# EasyEDA schematic SCH_placa_Rorgerio_IGBT_2026-07-28.json
TITLE: Sheet_1; REV: 1.0; Date: 2026-02-24; Sheet: 1/1; Company: Your Company
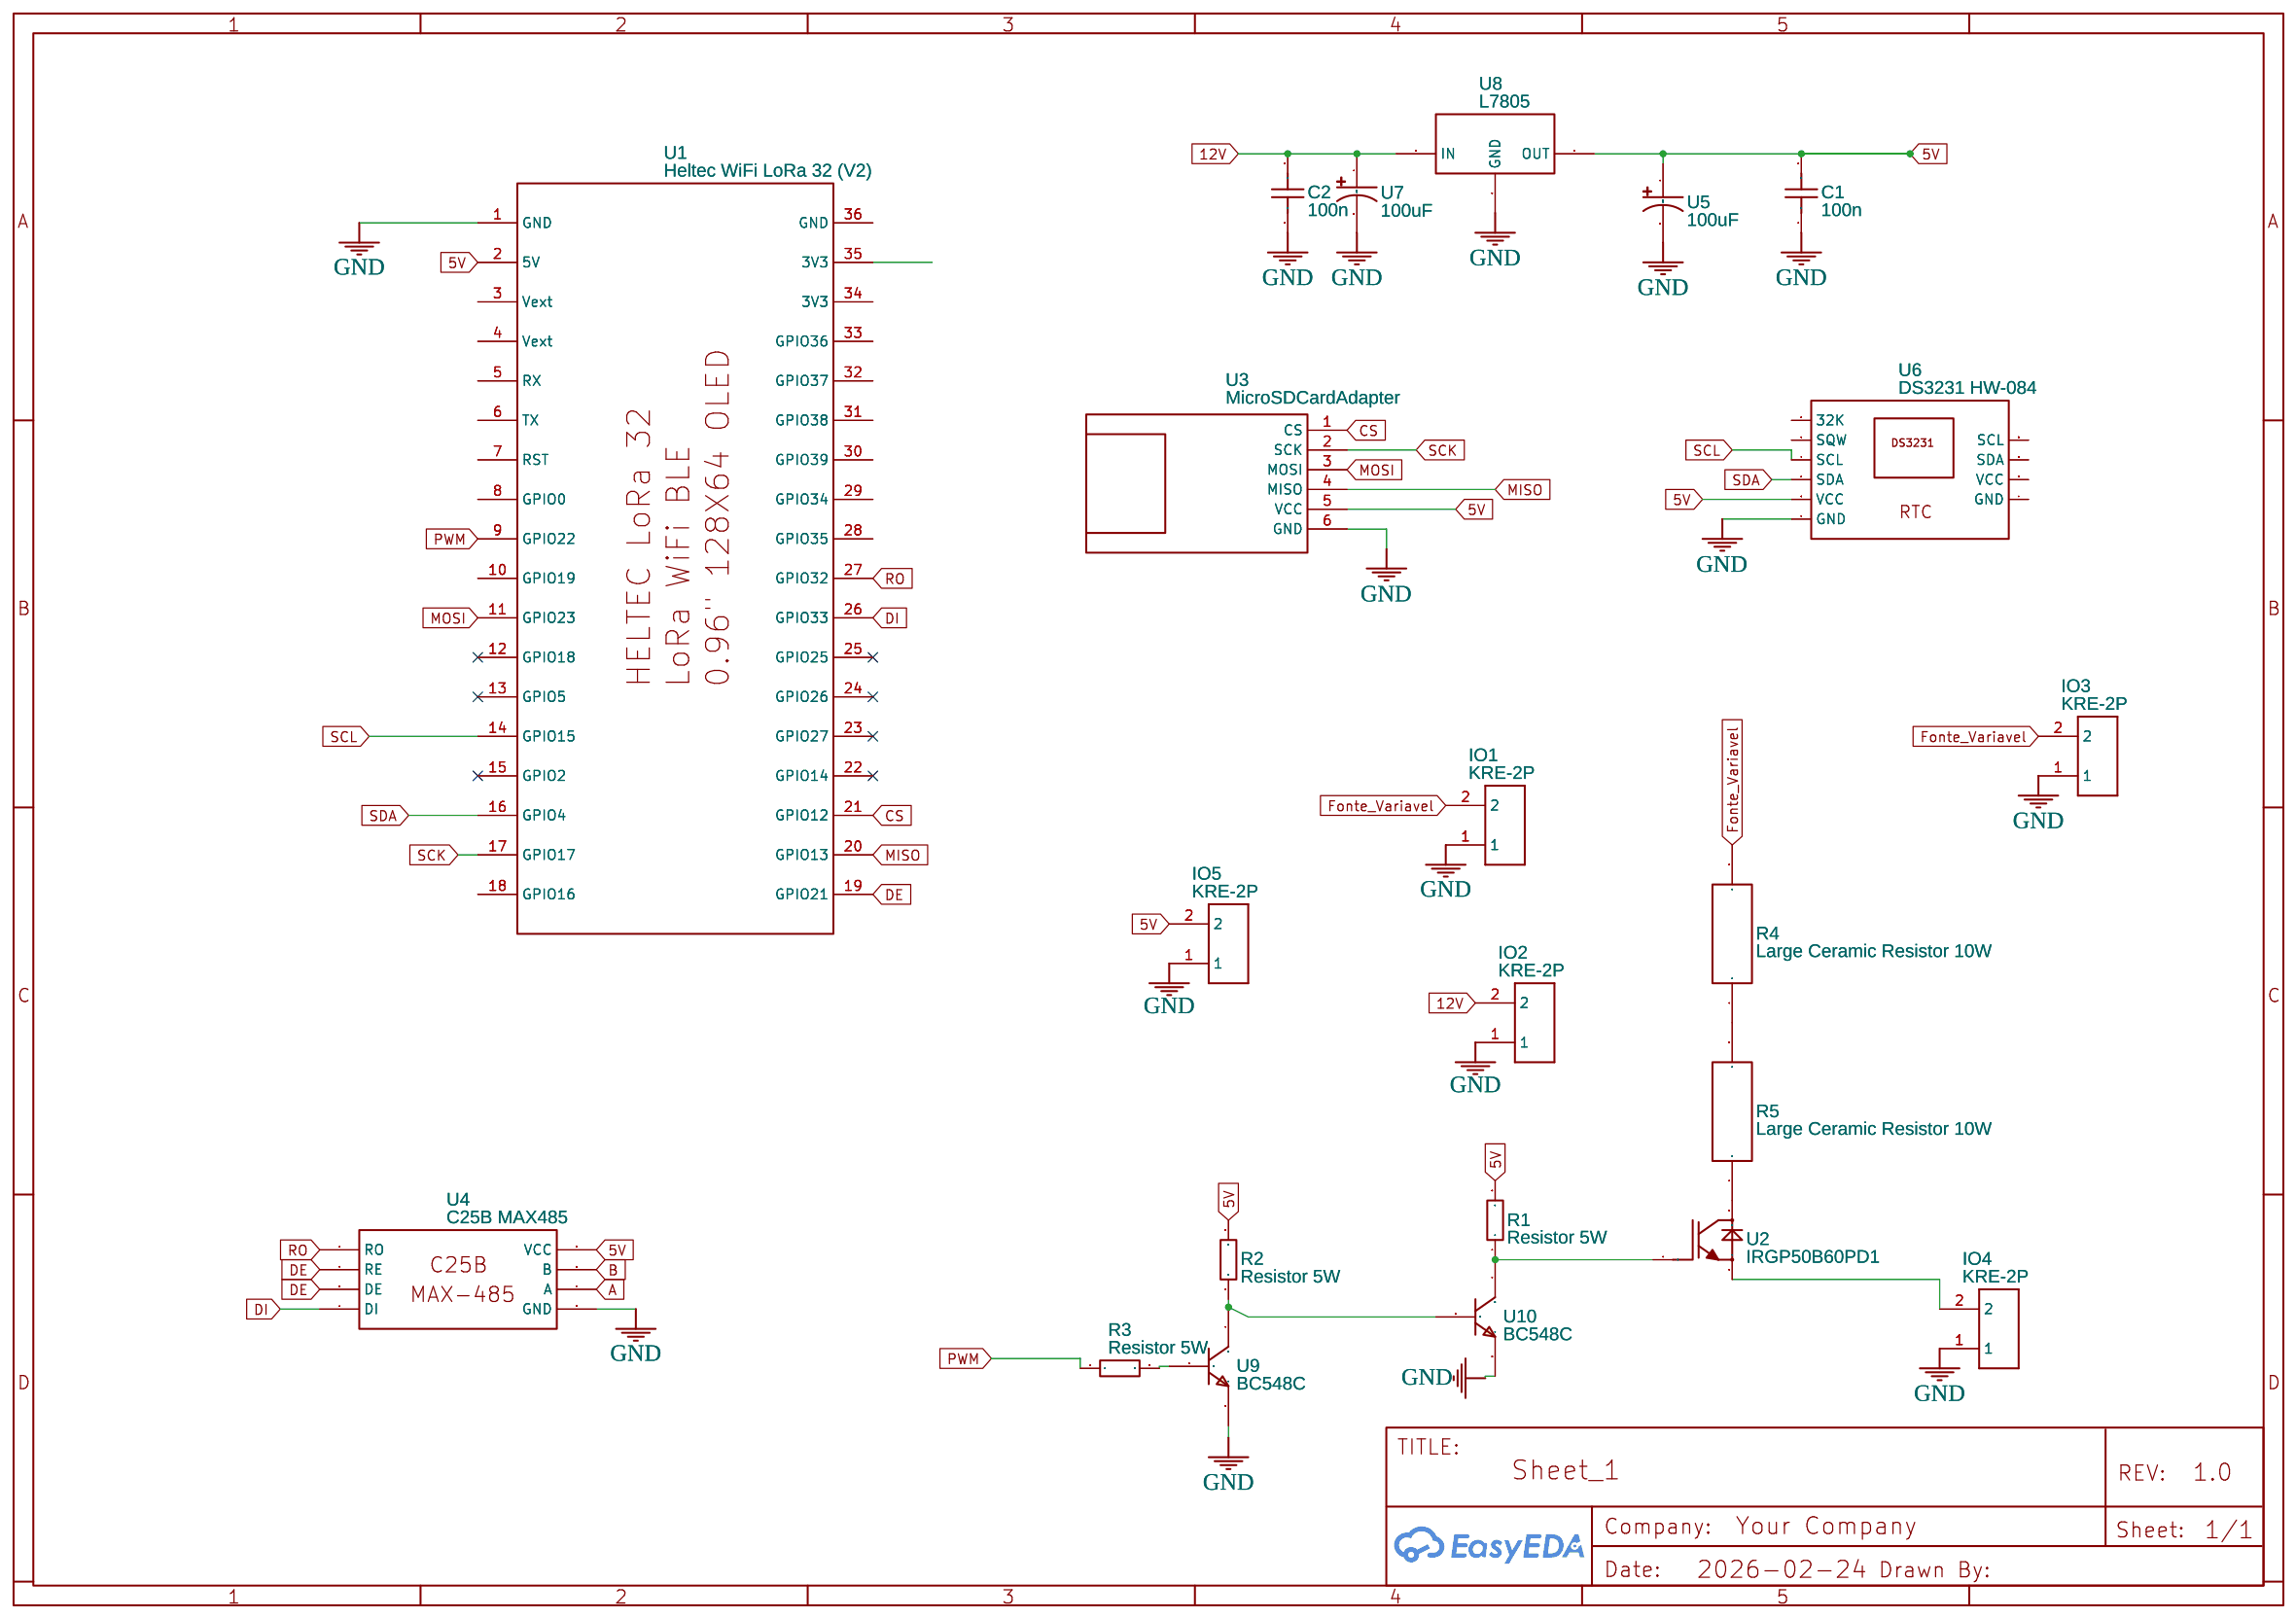
[diagram p0: schematic sheet]

## Parts
C1  100n  [100NF 63V MKS4-100N/100 WIMA]
C2  100n  [100NF 63V MKS4-100N/100 WIMA]
IO1  KRE-2P  [KRE-2P]
IO2  KRE-2P  [KRE-2P]
IO3  KRE-2P  [KRE-2P]
IO4  KRE-2P  [KRE-2P]
IO5  KRE-2P  [KRE-2P]
R1  Resistor 5W  [RESISTOR 5W]
R2  Resistor 5W  [RESISTOR 5W]
R3  Resistor 5W  [RESISTOR 5W]
R4  Large Ceramic Resistor 10W  [LARGE-CERAMIC-RESISTOR-10W-8OHM]
R5  Large Ceramic Resistor 10W  [LARGE-CERAMIC-RESISTOR-10W-8OHM]
U1  Heltec WiFi LoRa 32 (V2)  [HELTEC-LORA32-WIFI-BLE-OLED V2 A]
U2  IRGP50B60PD1  [MOSFET-D]
U3  MicroSDCardAdapter  [MICROSDCARDADAPTER]
U4  C25B MAX485  [C25B MAX485]
U5  100uF  [CAP100UF25V]
U6  DS3231 HW-084  [DS3231 HW-084]
U7  100uF  [CAP100UF25V]
U8  L7805  [L7805]
U9  BC548C  [BC548C]
U10  BC548C  [BC548C]

## Library data of the parts
C1 C2 = C_0603_US: Contributor: SrQuark
IO1-IO5 = KRE-2P: KRE Conector 2P
R1-R3 = Resistor 5W: Power: 2W; Tolerance: ±1%; Supplier Part: C57435; Supplier: LCSC; Manufacturer: UniOhm; Contributor: hafiz_8030
R4 R5 = Large Ceramic Resistor 10W: Manufacturer Part: Yontex MKP 250V 6.8uF; Contributor: azhaque
U1 = Heltec WiFi LoRa 32 (V2): Manufacturer: Heltec; Manufacturer Part: Heltec WiFi LoRa 32(V2); Supplier: Heltec; Supplier Part: Heltec WiFi LoRa 32(V2); link: https://heltec.org/project/wifi-lora-32/; Contributor: Domino2205
U2 = IRGP50B60PD1: Contributor: ledhengsant55
U3 = MicroSDCardAdapter: Contributor: sahilrnikam; Package Display: No; Supplier: Benewake
U4 = C25B MAX485: Contributor: Ahmad Burhan
U5 U7 = Cap100uF25V: Contributor: kevin_wu; Supplier: LCSC; Supplier Part: C2972604; Manufacturer: NCC(日本贵弥功); Manufacturer Part: EKY-101ETD101MK16S
U6 = DS3231 HW-084: Contributor: KSM_MA
U8 = L7805: Contributor: roihan.abror
U9 U10 = BC548C: Contributor: dale_willey

## Nets
5V: C1.2 IO5.2 R1.2 R2.2 U1.2(5V) U3.5(VCC) U4.5(VCC) U5.1 U6.2(VCC) U8.1(OUT)
12V: C2.2 IO2.2 U7.1 U8.3(IN)
GND: C1.1 C2.1 IO1.1 IO2.1 IO3.1 IO4.1 IO5.1 U1.1(GND) U3.6(GND) U4.8(GND) U5.2 U6.1(GND) U7.2 U8.2(GND) U9.3(E) U10.3(E)
A: U4.7(A)
B: U4.6(B)
CS: U1.21(GPIO12) U3.1(CS)
DE: U1.19(GPIO21) U4.2(RE) U4.3(DE)
DI: U1.26(GPIO33) U4.4(DI)
Fonte_Variavel: IO1.2 IO3.2 R4.2
MISO: U1.20(GPIO13) U3.4(MISO)
MOSI: U1.11(GPIO23) U3.3(MOSI)
PWM: R3.1 U1.9(GPIO22)
RO: U1.27(GPIO32) U4.1(RO)
SCK: U1.17(GPIO17) U3.2(SCK)
SCL: U1.14(GPIO15) U6.4(SCL)
SDA: U1.16(GPIO4) U6.3(SDA)
Net-(IO4-2): IO4.2 U2.3(E)
Net-(R1-1): R1.1 U2.1(G) U10.1(C)
Net-(R2-1): R2.1 U9.1(C) U10.2(B)
Net-(R3-2): R3.2 U9.2(B)
Net-(R4-1): R4.1 R5.2
Net-(R5-1): R5.1 U2.2(C)

Not connected (* = marked no-connect by the designer): U1 3(Vext) 4(Vext) 5(RX) 6(TX) 7(RST) 8(GPIO0) 10(GPIO19) 12(GPIO18)* 13(GPIO5)* 15(GPIO2)* 18(GPIO16) 22(GPIO14)* 23(GPIO27)* 24(GPIO26)* 25(GPIO25)* 28(GPIO35) 29(GPIO34) 30(GPIO39) 31(GPIO38) 32(GPIO37) 33(GPIO36) 34(3V3) 35(3V3) 36(GND); U6 5(SQW) 6(32K) 7(GND) 8(VCC) 9(SDA) 10(SCL)
